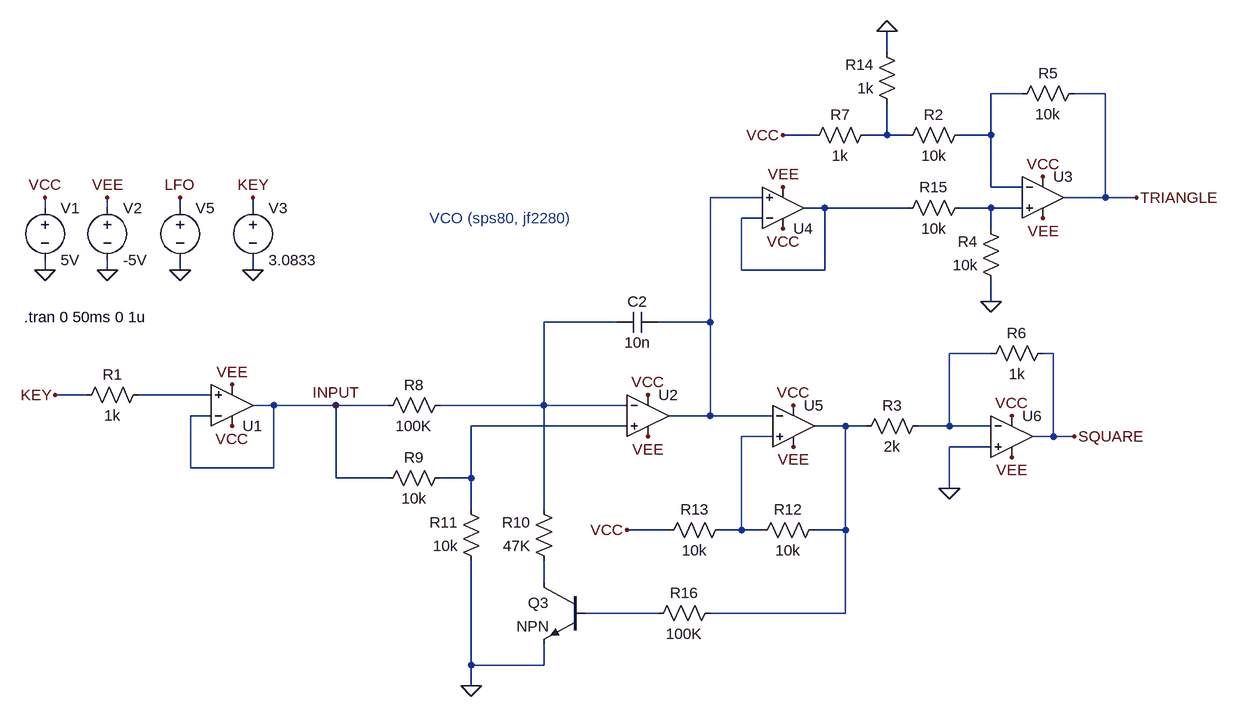
[diagram p0: schematic 260331-Synthesizer-EEE-VCO-sps80-jf2280-v2-00.asc]
260331-Synthesizer-EEE-VCO-sps80-jf2280-v2-00.asc, the LTspice schematic file:
Version 4.1
SHEET 1 3384 680
WIRE 1392 -448 1392 -480
WIRE 1600 -384 1552 -384
WIRE 1728 -384 1680 -384
WIRE 1280 -320 1232 -320
WIRE 1392 -320 1392 -368
WIRE 1392 -320 1360 -320
WIRE 1424 -320 1392 -320
WIRE 1552 -320 1552 -384
WIRE 1552 -320 1504 -320
WIRE 1552 -240 1552 -320
WIRE 1600 -240 1552 -240
WIRE 1200 -224 1120 -224
WIRE 1728 -224 1728 -384
WIRE 1728 -224 1664 -224
WIRE 1776 -224 1728 -224
WIRE 96 -208 96 -224
WIRE 192 -208 192 -224
WIRE 304 -208 304 -224
WIRE 416 -208 416 -224
WIRE 1296 -208 1264 -208
WIRE 1424 -208 1296 -208
WIRE 1552 -208 1504 -208
WIRE 1600 -208 1552 -208
WIRE 1200 -192 1168 -192
WIRE 1552 -176 1552 -208
WIRE 96 -112 96 -128
WIRE 192 -112 192 -128
WIRE 304 -112 304 -128
WIRE 416 -112 416 -128
WIRE 1168 -112 1168 -192
WIRE 1296 -112 1296 -208
WIRE 1296 -112 1168 -112
WIRE 1552 -64 1552 -96
WIRE 976 -32 864 -32
WIRE 1120 -32 1120 -224
WIRE 1120 -32 1040 -32
WIRE 1552 16 1488 16
WIRE 1648 16 1632 16
WIRE 160 80 112 80
WIRE 352 80 240 80
WIRE 448 96 416 96
WIRE 544 96 448 96
WIRE 624 96 544 96
WIRE 864 96 864 -32
WIRE 864 96 704 96
WIRE 992 96 864 96
WIRE 352 112 320 112
WIRE 1120 112 1120 -32
WIRE 1120 112 1056 112
WIRE 1216 112 1120 112
WIRE 992 128 752 128
WIRE 1328 128 1280 128
WIRE 1360 128 1328 128
WIRE 1488 128 1488 16
WIRE 1488 128 1440 128
WIRE 1552 128 1488 128
WIRE 1216 144 1168 144
WIRE 1648 144 1648 16
WIRE 1648 144 1616 144
WIRE 1680 144 1648 144
WIRE 1552 160 1488 160
WIRE 320 192 320 112
WIRE 448 192 448 96
WIRE 448 192 320 192
WIRE 544 208 544 96
WIRE 624 208 544 208
WIRE 752 208 752 128
WIRE 752 208 704 208
WIRE 1488 224 1488 160
WIRE 752 256 752 208
WIRE 864 256 864 96
WIRE 1056 288 992 288
WIRE 1168 288 1168 144
WIRE 1168 288 1136 288
WIRE 1200 288 1168 288
WIRE 1328 288 1328 128
WIRE 1328 288 1280 288
WIRE 864 368 864 336
WIRE 1040 416 928 416
WIRE 1328 416 1328 288
WIRE 1328 416 1120 416
WIRE 752 496 752 336
WIRE 864 496 864 464
WIRE 864 496 752 496
WIRE 752 528 752 496
FLAG 384 128 VCC
FLAG 384 64 VEE
FLAG 96 -112 0
FLAG 192 -112 0
FLAG 192 -224 VEE
FLAG 96 -224 VCC
FLAG 112 80 KEY
FLAG 416 -112 0
FLAG 416 -224 KEY
FLAG 1024 80 VCC
FLAG 752 528 0
FLAG 304 -112 0
FLAG 304 -224 LFO
FLAG 544 96 INPUT
FLAG 1024 144 VEE
FLAG 992 288 VCC
FLAG 1232 -320 VCC
FLAG 1392 -480 0
FLAG 1776 -224 TRIANGLE
FLAG 1632 -256 VCC
FLAG 1632 -192 VEE
FLAG 1552 -64 0
FLAG 1232 -176 VCC
FLAG 1232 -240 VEE
FLAG 1248 96 VCC
FLAG 1248 160 VEE
FLAG 1680 144 SQUARE
FLAG 1584 112 VCC
FLAG 1584 176 VEE
FLAG 1488 224 0
SYMBOL res 256 64 R90
WINDOW 0 0 56 VBottom 2
WINDOW 3 32 56 VTop 2
SYMATTR InstName R1
SYMATTR Value 1k
SYMBOL Opamps\\UniversalOpamp2 384 96 M180
SYMATTR InstName U1
SYMBOL voltage 96 -224 R0
WINDOW 123 0 0 Left 2
WINDOW 39 0 0 Left 2
SYMATTR InstName V1
SYMATTR Value 5V
SYMBOL voltage 192 -224 R0
WINDOW 123 0 0 Left 2
WINDOW 39 0 0 Left 2
SYMATTR InstName V2
SYMATTR Value -5V
SYMBOL voltage 416 -224 R0
WINDOW 123 0 0 Left 2
WINDOW 39 0 0 Left 2
SYMATTR InstName V3
SYMATTR Value 3.0833
SYMBOL Opamps\\UniversalOpamp2 1024 112 R0
SYMATTR InstName U2
SYMBOL res 720 80 R90
WINDOW 0 0 56 VBottom 2
WINDOW 3 32 56 VTop 2
SYMATTR InstName R8
SYMATTR Value 100K
SYMBOL res 720 192 R90
WINDOW 0 0 56 VBottom 2
WINDOW 3 32 56 VTop 2
SYMATTR InstName R9
SYMATTR Value 10k
SYMBOL res 880 352 R180
WINDOW 0 36 76 Left 2
WINDOW 3 36 40 Left 2
SYMATTR InstName R10
SYMATTR Value 47K
SYMBOL res 768 352 R180
WINDOW 0 36 76 Left 2
WINDOW 3 36 40 Left 2
SYMATTR InstName R11
SYMATTR Value 10k
SYMBOL npn 928 368 M0
SYMATTR InstName Q3
SYMBOL cap 1040 -48 R90
WINDOW 0 0 32 VBottom 2
WINDOW 3 32 32 VTop 2
SYMATTR InstName C2
SYMATTR Value 10n
SYMBOL Opamps\\UniversalOpamp2 1248 128 R0
SYMATTR InstName U5
SYMBOL res 1296 272 R90
WINDOW 0 0 56 VBottom 2
WINDOW 3 32 56 VTop 2
SYMATTR InstName R12
SYMATTR Value 10k
SYMBOL res 1152 272 R90
WINDOW 0 0 56 VBottom 2
WINDOW 3 32 56 VTop 2
SYMATTR InstName R13
SYMATTR Value 10k
SYMBOL voltage 304 -224 R0
WINDOW 123 0 0 Left 2
WINDOW 39 0 0 Left 2
SYMATTR InstName V5
SYMATTR Value ""
SYMBOL res 1136 400 R90
WINDOW 0 0 56 VBottom 2
WINDOW 3 32 56 VTop 2
SYMATTR InstName R16
SYMATTR Value 100K
SYMBOL res 1456 112 R90
WINDOW 0 0 56 VBottom 2
WINDOW 3 32 56 VTop 2
SYMATTR InstName R3
SYMATTR Value 2k
SYMBOL Opamps\\UniversalOpamp2 1632 -224 R0
SYMATTR InstName U3
SYMBOL res 1520 -336 R90
WINDOW 0 0 56 VBottom 2
WINDOW 3 32 56 VTop 2
SYMATTR InstName R2
SYMATTR Value 10k
SYMBOL res 1568 -80 R180
WINDOW 0 36 76 Left 2
WINDOW 3 36 40 Left 2
SYMATTR InstName R4
SYMATTR Value 10k
SYMBOL res 1696 -400 R90
WINDOW 0 0 56 VBottom 2
WINDOW 3 32 56 VTop 2
SYMATTR InstName R5
SYMATTR Value 10k
SYMBOL res 1376 -336 R90
WINDOW 0 0 56 VBottom 2
WINDOW 3 32 56 VTop 2
SYMATTR InstName R7
SYMATTR Value 1k
SYMBOL res 1408 -352 R180
WINDOW 0 36 76 Left 2
WINDOW 3 36 40 Left 2
SYMATTR InstName R14
SYMATTR Value 1k
SYMBOL res 1520 -224 R90
WINDOW 0 0 56 VBottom 2
WINDOW 3 32 56 VTop 2
SYMATTR InstName R15
SYMATTR Value 10k
SYMBOL Opamps\\UniversalOpamp2 1232 -208 M180
SYMATTR InstName U4
SYMBOL Opamps\\UniversalOpamp2 1584 144 R0
SYMATTR InstName U6
SYMBOL res 1648 0 R90
WINDOW 0 0 56 VBottom 2
WINDOW 3 32 56 VTop 2
SYMATTR InstName R6
SYMATTR Value 1k
TEXT 64 -40 Left 2 !.tran 0 50ms 0 1u
TEXT 688 -192 Left 2 ;VCO (sps80, jf2280)

The netlist it stands for:
* 260331-Synthesizer-EEE-VCO-sps80-jf2280-v2-00.asc
R1 N008 KEY 1k
X§U1 N008 INPUT VCC VEE INPUT level.2 Avol=1Meg GBW=10Meg Slew=10Meg ilimit=25m rail=0 Vos=0 phimargin=45 en=0 enk=0 in=0 ink=0 Rin=500Meg  ; pins IN+ IN- V+ V- OUT
V1 VCC 0 5V
V2 VEE 0 -5V
V3 KEY 0 3.0833
X§U2 N009 N006 VCC VEE N003 level.2 Avol=1Meg GBW=10Meg Slew=10Meg ilimit=25m rail=0 Vos=0 phimargin=45 en=0 enk=0 in=0 ink=0 Rin=500Meg  ; pins IN+ IN- V+ V- OUT
R8 N006 INPUT 100K
R9 N009 INPUT 10k
R10 N012 N006 47K
R11 0 N009 10k
Q3 N012 N013 0 0 NPN
C2 N003 N006 10n
X§U5 N011 N003 VCC VEE N010 level.2 Avol=1Meg GBW=10Meg Slew=10Meg ilimit=25m rail=0 Vos=0 phimargin=45 en=0 enk=0 in=0 ink=0 Rin=500Meg  ; pins IN+ IN- V+ V- OUT
R12 N010 N011 10k
R13 N011 VCC 10k
V5 LFO 0
R16 N010 N013 100K
R3 N007 N010 2k
X§U3 N005 N001 VCC VEE TRIANGLE level.2 Avol=1Meg GBW=10Meg Slew=10Meg ilimit=25m rail=0 Vos=0 phimargin=45 en=0 enk=0 in=0 ink=0 Rin=500Meg  ; pins IN+ IN- V+ V- OUT
R2 N001 N002 10k
R4 0 N005 10k
R5 TRIANGLE N001 10k
R7 N002 VCC 1k
R14 N002 0 1k
R15 N005 N004 10k
X§U4 N003 N004 VCC VEE N004 level.2 Avol=1Meg GBW=10Meg Slew=10Meg ilimit=25m rail=0 Vos=0 phimargin=45 en=0 enk=0 in=0 ink=0 Rin=500Meg  ; pins IN+ IN- V+ V- OUT
X§U6 0 N007 VCC VEE SQUARE level.2 Avol=1Meg GBW=10Meg Slew=10Meg ilimit=25m rail=0 Vos=0 phimargin=45 en=0 enk=0 in=0 ink=0 Rin=500Meg  ; pins IN+ IN- V+ V- OUT
R6 SQUARE N007 1k
.model NPN NPN
.model PNP PNP
.lib standard.bjt
.tran 0 50ms 0 1u
* VCO (sps80, jf2280)
.lib UniversalOpamps2.sub
.backanno
.end